# EasyEDA Pro project MSDRv2.eprj, board PCB1
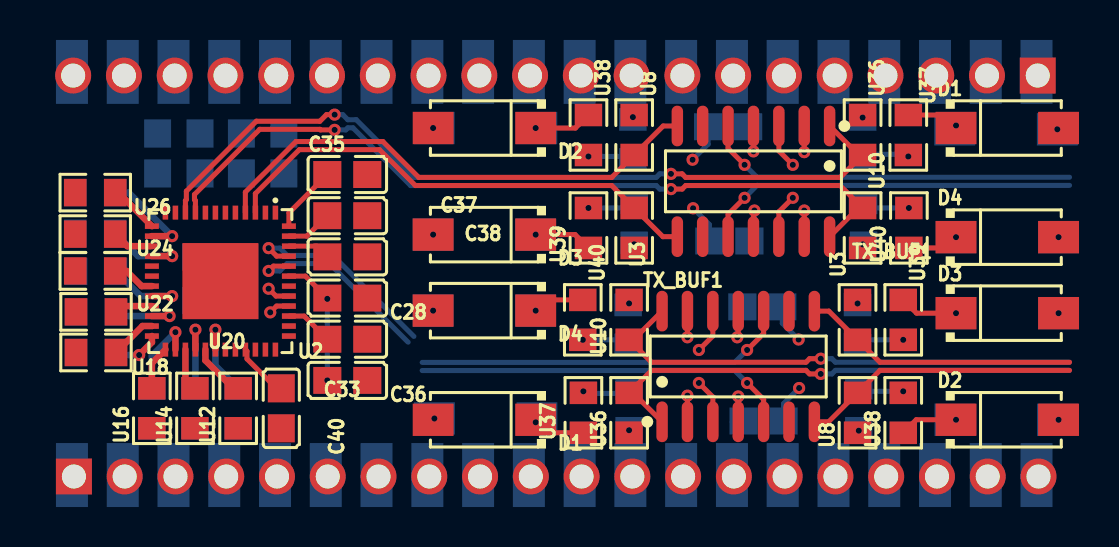
[diagram p6: board, top side]
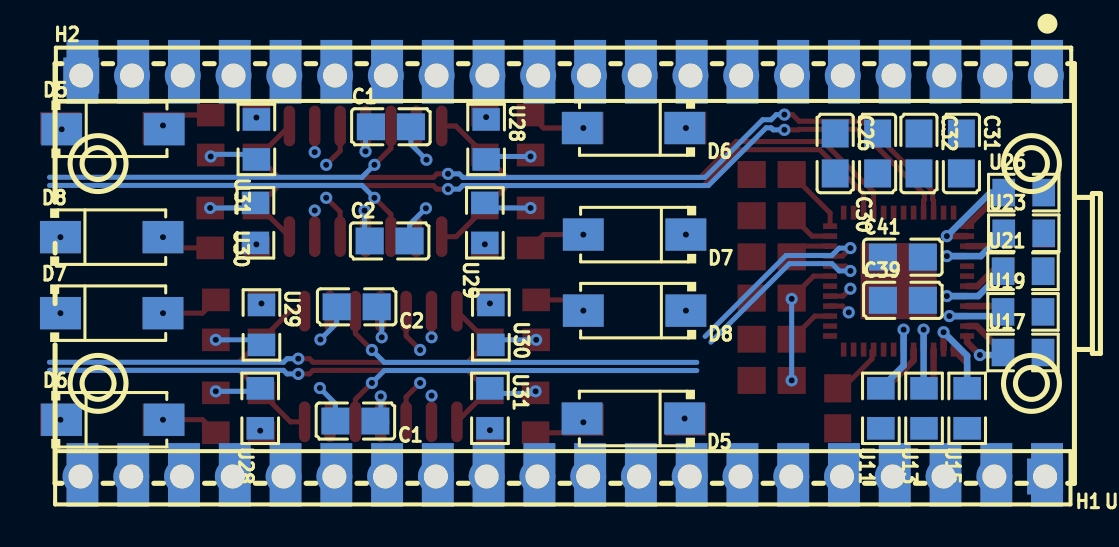
[diagram p7: board, bottom side, seen from below]

No outline. copper layers: Top Layer, Inner1, Inner2, Bottom Layer. Coordinates in mm from the lowest, leftmost part position.
Stack: Top Layer 0.035mm Outer layer thickness 1oz / Dielectric1 0.2104mm 7628 RC49% 8.6mil / Inner1 0.0152mm Inner layer thickness / Dielectric2 1.065mm 1.1mm H/HOZ Copper / Inner2 0.0152mm Inner layer thickness / Dielectric3 0.2104mm 7628 RC49% 8.6mil / Bottom Layer 0.035mm Outer layer thickness 1oz

## Design rules (mm)
net $1I519\RXIP: $1I519\RXI
net $1I519\RXIN: $1I519\RXI
net $1I519\RXQN: $1I519\RXQ
net $1I519\RXQP: $1I519\RXQ
net $1I519\TXQN: $1I519\TXQ
net $1I519\TXQP: $1I519\TXQ
net $1I519\TXIN: $1I519\TXI
net $1I519\TXIP: $1I519\TXI
template: JLCPCB Capability(Two Layers Board)
spacing copperThickness1oz (default): track to track 0.102, other pairs 0.152 to 0.3
spacing copperThickness2oz: track to track 0.203, other pairs 0.152 to 0.3
track width copperThickness1oz (default): min 0.127, default 0.254, max 2.54
track width copperThickness2oz: min 0.203, default 0.254, max 2.54
differential pair differentialPair (default): width min 0.127, default 0.254, max 2.54; gap min 0.152, default 0.152
via viaSize (default): diameter min 0.5, default 0.61, max 10; hole min 0.3, default 0.305, max 6.3

## Placement (name value [footprint] x y rotation side)
C1  -  [C0805]  31.66 17.5 180 bottom
C1#2  -  [C0805]  33.44 2.78 0 bottom
C2  -  [C0805]  31.72 11.79 180 bottom
C2#2  -  [C0805]  33.37 8.49 0 bottom
C26  330nF  [C0805]  9.43 16.17 270 bottom
C28  100nF  [C0805]  12.61 8.93 180 top
C30  100nF  [C0805]  7.31 16.17 90 bottom
C31  100nF  [C0805]  3.12 16.17 270 bottom
C32  100nF  [C0805]  5.24 16.17 270 bottom
C33  100nF  [C0805]  12.61 6.87 0 top
C35  330nF  [C0805]  12.61 15.11 0 top
C36  100nF  [C0805]  12.61 4.81 180 top
C37  330nF  [C0805]  12.61 13.05 180 top
C38  100nF  [C0805]  12.61 10.99 180 top
C39  100nF  [C0805]  6.05 8.82 180 bottom
C40  100nF  [C0805]  9.31 3.41 90 top
C41  100nF  [C0805]  6.05 10.98 180 bottom
D1  -  [SMA_L4.4-W2.8-LS5.4-RD]  45.63 17.44 0 top
D1#2  -  [SMA_L4.4-W2.8-LS5.4-RD]  19.47 2.84 180 top
D2  -  [SMA_L4.4-W2.8-LS5.4-RD]  19.47 17.44 180 top
D2#2  -  [SMA_L4.4-W2.8-LS5.4-RD]  45.63 2.84 0 top
D3  -  [SMA_L4.4-W2.8-LS5.4-RD]  19.47 12.11 180 top
D3#2  -  [SMA_L4.4-W2.8-LS5.4-RD]  45.63 8.17 0 top
D4  -  [SMA_L4.4-W2.8-LS5.4-RD]  45.63 11.98 0 top
D4#2  -  [SMA_L4.4-W2.8-LS5.4-RD]  19.47 8.3 180 top
D5  -  [SMA_L4.4-W2.8-LS5.4-RD]  45.57 17.38 180 bottom
D5#2  -  [SMA_L4.4-W2.8-LS5.4-RD]  19.53 2.9 0 bottom
D6  -  [SMA_L4.4-W2.8-LS5.4-RD]  19.52 17.44 0 bottom
D6#2  -  [SMA_L4.4-W2.8-LS5.4-RD]  45.58 2.84 180 bottom
D7  -  [SMA_L4.4-W2.8-LS5.4-RD]  19.47 12.11 0 bottom
D7#2  -  [SMA_L4.4-W2.8-LS5.4-RD]  45.63 8.17 180 bottom
D8  -  [SMA_L4.4-W2.8-LS5.4-RD]  45.63 11.98 180 bottom
D8#2  -  [SMA_L4.4-W2.8-LS5.4-RD]  19.47 8.3 0 bottom
H1  -  [HDR-TH_20P-P2.54-V-M-1]  23.06 0 0 bottom
H2  -  [HDR-TH_20P-P2.54-V-M-1]  23.02 20.07 180 bottom
TX_BUF1  -  [SOIC-14_L8.7-W3.9-P1.27-LS6.0-BL]  32.93 14.77 180 top
TX_BUF1#2  -  [SOIC-14_L8.7-W3.9-P1.27-LS6.0-BL]  32.17 5.51 0 top
U1  PICO  [COMM-SMD_L51.0-W21.0-P2.54_SC0916]  23.28 10.16 0 bottom
U2  MAX5864ETM+  [QFN-48_L7.0-W7.0-P0.50-BL-EP5.1]  6.26 9.78 180 top
U3  -  [R0805]  26.96 12.44 270 top
U3#2  -  [R0805]  38.14 7.84 90 top
U8  -  [R0805]  26.96 17.09 270 top
U8#2  -  [R0805]  38.14 3.19 90 top
U10  -  [R0805]  38.39 12.44 270 top
U10#2  -  [R0805]  26.71 7.84 90 top
U11  100  [R0805]  7.15 3.41 90 bottom
U12  100  [R0805]  7.15 3.41 90 top
U13  100  [R0805]  4.99 3.41 90 bottom
U14  100  [R0805]  4.99 3.41 90 top
U15  100  [R0805]  2.83 3.41 90 bottom
U16  100  [R0805]  2.83 3.41 90 top
U17  100  [R0805]  0.04 6.21 180 bottom
U18  100  [R0805]  0.04 6.21 180 top
U19  100  [R0805]  0.04 8.24 180 bottom
U20  100  [R0805]  0.04 8.24 180 top
U21  100  [R0805]  0.04 10.27 180 bottom
U22  100  [R0805]  0 10.29 180 top
U23  100  [R0805]  0 12.18 180 bottom
U24  100  [R0805]  0 12.13 180 top
U25  100  [R0805]  0 14.21 180 bottom
U26  100  [R0805]  0 14.21 180 top
U28  -  [R0805]  26.9 16.87 270 bottom
U28#2  -  [R0805]  38.2 3.41 90 bottom
U29  -  [R0805]  26.96 12.69 90 bottom
U29#2  -  [R0805]  38.14 7.59 270 bottom
U30  -  [R0805]  38.44 12.69 90 bottom
U30#2  -  [R0805]  26.66 7.59 270 bottom
U31  -  [R0805]  38.39 16.87 90 bottom
U31#2  -  [R0805]  26.71 3.41 270 bottom
U36  -  [R0805]  38.39 17.09 270 top
U36#2  -  [R0805]  26.71 3.19 90 top
U37  -  [R0805]  40.68 17.09 270 top
U37#2  -  [R0805]  24.42 3.19 90 top
U38  -  [R0805]  24.68 17.09 270 top
U38#2  -  [R0805]  40.42 3.19 90 top
U39  -  [R0805]  24.68 12.44 90 top
U39#2  -  [R0805]  40.42 7.84 270 top
U40  -  [R0805]  40.71 12.44 90 top
U40#2  -  [R0805]  24.39 7.84 270 top

## Footprints (pads in the part's own frame, mm; a bottom-side part is the same pattern mirrored in y, then rotated)
C0805
  rect 1.41x1.35 smd: 1(-1,0) 2(1,0)
COMM-SMD_L51.0-W21.0-P2.54_SC0916
  rect 1.6x3.2 smd: 1(-24.445,-10.088) 2(-21.905,-10.088) 3(-19.365,-10.088) 4(-16.825,-10.088) 5(-14.285,-10.088) 6(-11.745,-10.088) 7(-9.205,-10.088) 8(-6.665,-10.088) 9(-4.125,-10.088) 10(-1.585,-10.088) 11(0.955,-10.088) 12(3.495,-10.088) 13(6.035,-10.088) 14(8.575,-10.088) 15(11.115,-10.088) 16(13.655,-10.088) 17(16.195,-10.088) 18(18.735,-10.088) 19(21.275,-10.088) 20(23.815,-10.088) 21(23.815,10.088) 22(21.275,10.088) 23(18.735,10.088) 24(16.195,10.088) 25(13.655,10.088) 26(11.115,10.088) 27(8.575,10.088) 28(6.035,10.088) 29(3.495,10.088) 30(0.955,10.088) 31(-1.585,10.088) 32(-4.125,10.088) 33(-6.665,10.088) 34(-9.205,10.088) 35(-11.745,10.088) 36(-14.285,10.088) 37(-16.825,10.088) 38(-19.365,10.088) 39(-21.905,10.088) 40(-24.445,10.088)
HDR-TH_20P-P2.54-V-M-1
  rect 1.8x1.8 hole 1.2: 1(-24.13,0)
  round 1.8 hole 1.2: 2(-21.59,0) 3(-19.05,0) 4(-16.51,0) 5(-13.97,0) 6(-11.43,0) 7(-8.89,0) 8(-6.35,0) 9(-3.81,0) 10(-1.27,0) 11(1.27,0) 12(3.81,0) 13(6.35,0) 14(8.89,0) 15(11.43,0) 16(13.97,0) 17(16.51,0) 18(19.05,0) 19(21.59,0) 20(24.13,0)
QFN-48_L7.0-W7.0-P0.50-BL-EP5.1
  rect 0.28x0.7 smd: 1(-2.75,-3.428) 2(-2.25,-3.428) 3(-1.75,-3.428) 4(-1.25,-3.428) 5(-0.75,-3.428) 6(-0.25,-3.428) 7(0.25,-3.428) 8(0.75,-3.428) 9(1.25,-3.428) 10(1.75,-3.428) 11(2.25,-3.428) 12(2.75,-3.428) 25(2.75,3.428) 26(2.25,3.428) 27(1.75,3.428) 28(1.25,3.428) 29(0.75,3.428) 30(0.25,3.428) 31(-0.25,3.428) 32(-0.75,3.428) 33(-1.25,3.428) 34(-1.75,3.428) 35(-2.25,3.428) 36(-2.75,3.428)
  rect 0.7x0.28 smd: 13(3.428,-2.75) 14(3.428,-2.25) 15(3.428,-1.75) 16(3.428,-1.25) 17(3.428,-0.75) 18(3.428,-0.25) 19(3.428,0.25) 20(3.428,0.75) 21(3.428,1.25) 22(3.428,1.75) 23(3.428,2.25) 24(3.428,2.75) 37(-3.428,2.75) 38(-3.428,2.25) 39(-3.428,1.75) 40(-3.428,1.25) 41(-3.428,0.75) 42(-3.428,0.25) 43(-3.428,-0.25) 44(-3.428,-0.75) 45(-3.428,-1.25) 46(-3.428,-1.75) 47(-3.428,-2.25) 48(-3.428,-2.75)
  rect 3.81x3.81 smd: 49(0,0)
R0805
  rect 1.133x1.377 smd: 1(-1,0) 2(1,0)
SMA_L4.4-W2.8-LS5.4-RD
  rect 2.046x1.62 smd: 1(-2.566,0) 2(2.566,0)
SOIC-14_L8.7-W3.9-P1.27-LS6.0-BL
  oval 0.574x2.038 smd: 1(-3.81,-2.769) 2(-2.54,-2.769) 3(-1.27,-2.769) 4(0,-2.769) 5(1.27,-2.769) 6(2.54,-2.769) 7(3.81,-2.769) 8(3.81,2.769) 9(2.54,2.769) 10(1.27,2.769) 11(0,2.769) 12(-1.27,2.769) 13(-2.54,2.769) 14(-3.81,2.769)

## Nets
+5V: C1.1 C1#2.1 TX_BUF1.4 TX_BUF1#2.4
-5V: C2.1 C2#2.1 TX_BUF1.11 TX_BUF1#2.11
GND: C1.2 C1#2.2 C2.2 C2#2.2 C26.1 C28.1 C30.2 C31.1 C32.1 C33.2 C35.2 C36.1 C37.1 C38.1 C39.1 C40.1 C41.1 U2.5 U2.7 U2.12 U2.31 U2.32 U2.37 U2.42 U28.2 U28#2.2 U29.2 U29#2.2 U30.2 U30#2.2 U31.1 U31#2.1 U37.2 U37#2.2 U38.2 U38#2.2 U39.2 U39#2.2 U40.2 U40#2.2
VCC: C28.2 C30.1 C31.2 C32.2 C33.1 C36.2 C38.2 C39.2 C40.2 C41.2 U2.2 U2.8 U2.11 U2.18 U2.33 U2.39 U2.43 U2.46
$1I519\$1N1602: C37.2 U2.47
$1I519\$1N1605: U2.30 U11.2
$1I519\$1N1608: U2.29 U12.2
$1I519\$1N1611: U2.28 U13.2
$1I519\$1N1614: U2.27 U14.2
$1I519\$1N1617: U2.26 U15.2
$1I519\$1N1620: U2.25 U16.2
$1I519\$1N1625: U2.24 U17.1
$1I519\$1N1628: U2.23 U18.1
$1I519\$1N1633: U2.21 U20.1
$1I519\$1N1636: U2.20 U21.1
$1I519\$1N1639: U2.19 U22.1
$1I519\$1N1642: U2.16 U23.1
$1I519\$1N1645: U2.15 U24.1
$1I519\$1N1648: U2.14 U25.1
$1I519\$1N1651: U2.13 U26.1
$1I519\$1N1653: C35.1 U2.48
$1I519\$1N1654: C26.2 U2.1
$1I519\$1N1662: U2.22 U19.1
$1I519\BBC_CLK: U2.6
$1I519\BBC_DA0: U26.2
$1I519\BBC_DA1: U25.2
$1I519\BBC_DA2: U24.2
$1I519\BBC_DA3: U23.2
$1I519\BBC_DA4: U22.2
$1I519\BBC_DA5: U21.2
$1I519\BBC_DA6: U20.2
$1I519\BBC_DA7: U19.2
$1I519\BBC_DD0: U18.2
$1I519\BBC_DD1: U17.2
$1I519\BBC_DD2: U16.1
$1I519\BBC_DD3: U15.1
$1I519\BBC_DD4: U14.1
$1I519\BBC_DD5: U13.1
$1I519\BBC_DD6: U12.1
$1I519\BBC_DD7: U11.1
$1I519\CS#: U2.36
$1I519\DIN: U2.34
$1I519\RXIN: TX_BUF1.7 U2.4 U8.2
$1I519\RXIP: TX_BUF1.8 U2.3 U3.1
$1I519\RXQN: TX_BUF1.14 U2.9 U10.1
$1I519\RXQP: TX_BUF1.1 U2.10 U36.2
$1I519\SCLK: U2.35
$1I519\TXIN: U2.44
$1I519\TXIP: U2.45
$1I519\TXQN: U2.40
$1I519\TXQP: U2.41
IN1: TX_BUF1.12 TX_BUF1#2.12
IN2: TX_BUF1.3 TX_BUF1#2.3
IN3: TX_BUF1.5 TX_BUF1#2.5
IN4: TX_BUF1.10 TX_BUF1#2.10
OUT1: TX_BUF1#2.14 U10#2.1
OUT2: TX_BUF1#2.1 U36#2.2
OUT3: TX_BUF1#2.7 U8#2.2
OUT4: TX_BUF1#2.8 U3#2.1
$1N285: H1.20 U1.21
$1N287: H1.19 U1.22
$1N289: H1.18 U1.23
$1N291: H1.17 U1.24
$1N293: H1.16 U1.25
$1N295: H1.15 U1.26
$1N297: H1.14 U1.27
$1N299: H1.13 U1.28
$1N301: H1.12 U1.29
$1N303: H1.11 U1.30
$1N305: H1.10 U1.31
$1N307: H1.9 U1.32
$1N309: H1.8 U1.33
$1N311: H1.7 U1.34
$1N313: H1.6 U1.35
$1N315: H1.5 U1.36
$1N317: H1.4 U1.37
$1N319: H1.3 U1.38
$1N321: H1.2 U1.39
$1N323: H1.1 U1.40
$1N402: H2.20 U1.1
$1N404: H2.19 U1.2
$1N406: H2.18 U1.3
$1N408: H2.17 U1.4
$1N410: H2.16 U1.5
$1N412: H2.15 U1.6
$1N414: H2.14 U1.7
$1N416: H2.13 U1.8
$1N418: H2.12 U1.9
$1N420: H2.11 U1.10
$1N422: H2.10 U1.11
$1N424: H2.9 U1.12
$1N426: H2.8 U1.13
$1N428: H2.7 U1.14
$1N430: H2.6 U1.15
$1N432: H2.5 U1.16
$1N434: H2.4 U1.17
$1N436: H2.3 U1.18
$1N438: H2.2 U1.19
$1N440: H2.1 U1.20
$1N983: D1.1 D1#2.1 D5.2 D5#2.2 U37.1 U37#2.1
$1N984: D1.2 D1#2.2 D5.1 D5#2.1 TX_BUF1.2 TX_BUF1#2.2 U31.2 U31#2.2 U36.1 U36#2.1
$1N985: D2.2 D2#2.2 D6.1 D6#2.1 TX_BUF1.6 TX_BUF1#2.6 U8.1 U8#2.1 U28.1 U28#2.1
$1N986: D2.1 D2#2.1 D6.2 D6#2.2 U38.1 U38#2.1
$1N987: D3.1 D3#2.1 D7.2 D7#2.2 U39.1 U39#2.1
$1N988: D3.2 D3#2.2 D7.1 D7#2.1 TX_BUF1.9 TX_BUF1#2.9 U3.2 U3#2.2 U29.1 U29#2.1
$1N989: D4.2 D4#2.2 D8.1 D8#2.1 TX_BUF1.13 TX_BUF1#2.13 U10.2 U10#2.2 U30.1 U30#2.1
$1N990: D4.1 D4#2.1 D8.2 D8#2.2 U40.1 U40#2.1

Pads without a net: U2 17 38 49

## Via types
v1: diameter 0.61, hole 0.305, Top Layer to Bottom Layer, 72 vias

## Routing (per net, layer and track width the routed paths; a pad name or vN(x,y) marks a point on that pad's centre or on a via; arc(x,y) is an arc through that point)
+5V: length 5.4
  Top Layer w0.254: 32.17,2.74 v1(32.17,4.01) ; TX_BUF1.4 v1(32.93,16.27)
  Bottom Layer w0.254: v1(32.93,16.27) 32.93,17.26 33.23,17.57 ; 31.87,2.71 32.17,3.01 v1(32.17,4.01)
-5V: length 5.4
  Top Layer w0.254: v1(32.98,13.31) 32.93,13.26 TX_BUF1.11 ; v1(32.12,6.97) 32.17,7.02 TX_BUF1#2.11
  Bottom Layer w0.254: v1(32.12,6.97) 32.12,7.98 31.87,8.24 ; 33.23,12.04 32.98,12.3 v1(32.98,13.31)
GND: length 26.2
  Bottom Layer w0.254: v1(29.91,13.42) 30.72,12.61 C2.2 ; 38.14,6.84 v1(40.42,6.84) ; 38.44,13.44 v1(40.71,13.44) ; 38.2,4.16 38.31,4.26 v1(40.42,4.26) ; C2#2.2 34.37,7.67 v1(35.19,6.86) ; C1.2 30.66,16.63 v1(29.88,15.85) ; v1(35.22,4.43) 34.44,3.65 C1#2.2 ; v1(24.68,16.02) 26.79,16.02 26.9,16.12 ; 26.71,4.16 24.53,4.16 v1(24.42,4.26) ; 26.96,13.44 v1(24.68,13.44) ; 38.39,16.12 40.57,16.12 v1(40.68,16.02) ; 26.66,6.84 v1(24.39,6.84)
VCC: length 13.9
  Top Layer w0.254: U2.33 7.59,6.27 7.59,5.89 9.07,4.41 C40.2 ; U2.46 11.07,11.53 C38.2 ; C33.1 10.45,8.03 U2.39 ; v1(11.61,8.89) C28.2 10.51,10.03 U2.43
  Bottom Layer w0.254: v1(11.61,4.81) v1(11.61,8.89)
$1I519\$1N1602: length 2.3
  Top Layer w0.254: C37.2 10.59,12.03 U2.47
$1I519\$1N1605: length 4.4
  Top Layer w0.33: U2.30 v1(6.01,7.35)
  Bottom Layer w0.33: U11.2 6.01,5.55 v1(6.01,7.35)
$1I519\$1N1608: length 2.8
  Top Layer w0.33: U2.29 5.51,5.81 6.91,4.41 U12.2
$1I519\$1N1611: length 3.9
  Top Layer w0.33: U2.28 v1(5.01,7.35)
  Bottom Layer w0.33: U13.2 5.01,4.43 v1(5.01,7.35)
$1I519\$1N1614: length 2.1
  Top Layer w0.33: U14.2 4.51,4.89 U2.27
$1I519\$1N1617: length 4.2
  Top Layer w0.33: U2.26 v1(4.01,7.22)
  Bottom Layer w0.33: U15.2 2.83,6.04 v1(4.01,7.22)
$1I519\$1N1620: length 2.2
  Top Layer w0.33: U16.2 2.83,5.67 U2.25
$1I519\$1N1625: length 2.4
  Top Layer w0.33: v1(2.2,6.08) 2.83,6.72 U2.24
  Bottom Layer w0.33: v1(2.2,6.08) 1.16,6.08 U17.1
$1I519\$1N1628: length 2.3
  Top Layer w0.33: U2.23 2.36,7.53 U18.1
$1I519\$1N1633: length 1.9
  Top Layer w0.33: U20.1 1.33,8.53 U2.21
$1I519\$1N1636: length 4.3
  Top Layer w0.33: U2.20 v1(3.85,9.03)
  Bottom Layer w0.33: U21.1 2.28,9.03 v1(3.85,9.03)
$1I519\$1N1639: length 2.1
  Top Layer w0.33: U2.19 2.32,9.53 1.56,10.29 U22.1
$1I519\$1N1642: length 4.3
  Top Layer w0.33: U2.16 v1(3.85,11.03)
  Bottom Layer w0.33: v1(3.85,11.03) 2.15,11.03 U23.1
$1I519\$1N1645: length 2.1
  Top Layer w0.33: U24.1 1.6,11.53 U2.15
$1I519\$1N1648: length 4.8
  Top Layer w0.33: U2.14 v1(3.85,12.03)
  Bottom Layer w0.33: U25.1 1.67,14.21 v1(3.85,12.03)
$1I519\$1N1651: length 2.5
  Top Layer w0.33: U2.13 1.16,14.21 U26.1
$1I519\$1N1653: length 3.4
  Top Layer w0.254: U2.48 9.69,13.19 C35.1
$1I519\$1N1662: length 3.7
  Top Layer w0.33: U2.22 v1(3.72,8.03)
  Bottom Layer w0.33: v1(3.72,8.03) 1.25,8.03 U19.1
$1I519\RXIN: length 25.5
  Top Layer w0.254: TX_BUF1.7 28.41,17.54 U8.2 25.84,14.97 16.18,14.97 14.39,16.76 10.04,16.76 7.51,14.23 U2.4
$1I519\RXIP: length 24.8
  Top Layer w0.254: TX_BUF1.8 28.4,12 U3.1 25.84,14.56 16.02,14.56 14.22,16.36 10.21,16.36 8.01,14.16 U2.3
$1I519\RXQN: length 39.8
  Top Layer w0.254: v1(11.98,17.35) 11.27,17.35 11.24,17.37 8.23,17.37 4.96,14.11 4.96,13.86 5.01,13.81 U2.9 ; TX_BUF1.14 38.18,13.44 U10.1 37.27,14.56 29.54,14.56 29.36,14.38 v1(28.8,14.38)
  Bottom Layer w0.254: v1(28.8,14.38) 28.24,14.38 28.07,14.56 15.78,14.56 12.89,17.45 12.64,17.45 12.53,17.35 v1(11.98,17.35)
$1I519\RXQP: length 40.7
  Top Layer w0.254: v1(28.8,15.15) 29.36,15.15 29.54,14.97 37.27,14.97 U36.2 38.19,16.09 TX_BUF1.1 ; U2.10 4.51,13.81 4.56,13.86 4.56,14.28 8.06,17.78 11.24,17.78 11.57,18.11 v1(11.98,18.11)
  Bottom Layer w0.254: v1(28.8,15.15) 28.24,15.15 28.07,14.97 15.95,14.97 13.06,17.86 12.64,17.86 12.38,18.11 v1(11.98,18.11)
$1I519\TXIN: length 9.9
  Top Layer w0.254: v1(8.67,10.29) 8.92,10.53 U2.44
  Bottom Layer w0.254: v1(8.67,10.29) 9.23,10.29 9.6,10.66 11.72,10.66 15.65,6.72
$1I519\TXIP: length 10.3
  Top Layer w0.254: v1(8.67,11.43) 9.07,11.03 U2.45
  Bottom Layer w0.254: 15.94,7.01 11.89,11.06 9.6,11.06 9.23,11.43 v1(8.67,11.43)
$1I519\TXQN: length 9
  Top Layer w0.254: U2.40 9.07,8.53 v1(8.75,8.21)
  Inner1 w0.254: 15.15,5.31 13.25,5.31 9.96,8.6 9.7,8.6 9.31,8.21 v1(8.75,8.21)
$1I519\TXQP: length 9.2
  Top Layer w0.254: v1(8.67,9.4) 9.04,9.03 U2.41
  Inner1 w0.254: v1(8.67,9.4) 9.23,9.4 9.62,9.01 10.12,9.01 13.42,5.72 15.15,5.72
IN1: length 32.7
  Top Layer w0.254: TX_BUF1.12 34.2,13.25 v1(34.9,13.95) ; TX_BUF1#2.12 30.9,7.03 v1(30.2,6.33)
  Inner1 w0.254: v1(30.2,6.33) 29.58,5.71 16.36,5.71 ; v1(34.9,13.95) 35.52,14.57 48.74,14.57
IN2: length 32.7
  Top Layer w0.254: TX_BUF1.3 34.2,16.3 v1(34.9,15.6) ; 30.9,2.74 30.9,3.98 v1(30.2,4.68)
  Inner1 w0.254: v1(34.9,15.6) 35.52,14.98 48.74,14.98 ; 16.36,5.3 29.58,5.3 v1(30.2,4.68)
IN3: length 37.6
  Top Layer w0.254: TX_BUF1.5 31.66,16.42 v1(32.49,15.6) ; 33.44,2.74 33.44,3.86 v1(32.61,4.68)
  Bottom Layer w0.254: 16.36,5.3 31.99,5.3 v1(32.61,4.68) ; 48.74,14.98 33.11,14.98 v1(32.49,15.6)
IN4: length 37.6
  Top Layer w0.254: TX_BUF1#2.10 33.44,7.16 v1(32.61,6.33) ; v1(32.49,13.95) 31.66,13.12 TX_BUF1.10
  Bottom Layer w0.254: 16.36,5.71 31.99,5.71 v1(32.61,6.33) ; v1(32.49,13.95) 33.11,14.57 48.74,14.57
OUT1: length 24.9
  Top Layer w0.254: TX_BUF1#2.14 26.92,6.84 U10#2.1 27.83,5.72 35.56,5.72 35.74,5.9 v1(36.3,5.9)
  Bottom Layer w0.254: 48.74,5.72 37.03,5.72 36.85,5.9 v1(36.3,5.9)
OUT2: length 24.9
  Top Layer w0.254: v1(36.3,5.13) 35.74,5.13 35.56,5.31 27.83,5.31 U36#2.2 26.91,4.19 28.36,2.74
  Bottom Layer w0.254: 48.74,5.31 37.03,5.31 36.85,5.13 v1(36.3,5.13)
OUT3: length 13.8
  Top Layer w0.254: 48.74,5.31 39.26,5.31 U8#2.2 36.69,2.74 35.98,2.74
OUT4: length 13.8
  Top Layer w0.254: 48.74,5.72 39.26,5.72 U3#2.1 36.7,8.28 TX_BUF1#2.8
$1N983: length 5.2
  Top Layer w0.254: v1(43.07,17.57) 42.54,18.09 U37.1 ; v1(22.03,2.71) 22.56,2.19 U37#2.1
$1N984: length 31.9
  Top Layer w0.254: v1(35.47,16.23) 35.47,17.54 ; v1(29.63,4.05) 29.63,2.74
  Inner1 w0.254: 25.69,3.41 28.99,3.41 v1(29.63,4.05) ; 25.69,3.41 22.42,3.41 22.4,3.42 21.92,3.42 21.91,3.41 17.6,3.41 17.22,3.03 17.09,3.03 v1(16.97,2.9) ; 25.69,3.41 26.71,2.39 v1(26.71,2.32) ; v1(35.47,16.23) 36.11,16.87 39.41,16.87 ; 39.41,16.87 38.39,17.89 v1(38.39,17.96) ; 39.41,16.87 42.68,16.87 42.7,16.86 43.18,16.86 43.19,16.87 47.5,16.87 47.88,17.25 48.01,17.25 v1(48.13,17.38)
$1N985: length 21.5
  Inner1 w0.254: v1(16.9,17.44) 17.49,16.86 22.28,16.86 22.29,16.87 25.82,16.87 26.9,17.95 v1(26.9,17.99) ; v1(38.2,2.29) 38.2,2.33 39.28,3.41 42.81,3.41 42.82,3.42 47.61,3.42 v1(48.2,2.84)
$1N986: length 5.8
  Top Layer w0.254: U38#2.1 41.07,2.84 v1(43.07,2.84) ; U38.1 24.02,17.44 v1(22.03,17.44)
$1N987: length 5.8
  Top Layer w0.254: v1(22.03,12.11) 24.01,12.11 U39.1 ; U39#2.1 41.09,8.17 v1(43.07,8.17)
$1N988: length 21.5
  Inner1 w0.254: v1(48.2,8.17) 47.61,7.59 42.82,7.59 42.81,7.6 39.19,7.6 v1(38.14,8.66) ; v1(16.9,12.11) 17.49,12.69 22.28,12.69 22.29,12.68 25.91,12.68 v1(26.96,11.62)
$1N989: length 31.8
  Top Layer w0.254: v1(35.47,13.31) 35.47,12 ; v1(29.63,6.97) 29.63,8.27
  Inner1 w0.254: v1(29.63,6.97) 28.87,7.73 25.78,7.73 ; 39.32,12.55 42.81,12.55 42.82,12.56 47.61,12.56 v1(48.2,11.98) ; 39.32,12.55 36.23,12.55 v1(35.47,13.31) ; 39.32,12.55 v1(38.39,11.62) ; v1(26.71,8.66) 25.78,7.73 ; 25.78,7.73 22.29,7.73 22.28,7.72 17.49,7.72 v1(16.9,8.3)
$1N990: length 5.2
  Top Layer w0.254: v1(22.03,8.3) 22.57,8.84 U40#2.1 ; v1(43.07,11.98) 42.53,11.44 U40.1
